# Altium schematic sheet MCU_CU Schematic.SchDoc: Title
size A3; SheetTitle: MCU_CU Schematic; ApprovalDate: dd/mm/yyyy; DesignedBy: Boris Sharff; PageSetup: Record=PageOptions|CenterHorizontal=True|CenterVertical=True|PrintScale=1.01|XCorrection=1.00|YCorrection=1.00|PrintKind=1|BorderSize=5000000|LeftOffset=0|BottomOffset=0|Orientation=2|PaperLength=1000|PaperWidth=1000|Scale=100|PaperSource=7|PrintQuality=600|MediaType=1|DitherType=10|PaperKind=A3 (297 x 420mm)|PrintScaleMode=1; Title2: MCU_CU Schematic; Date: *******; ApprovedBy: *******; CheckedBy: None; Author: *******; CompanyName: *******; DrawnBy: Name; Engineer: *******; Organization: *******; Address1: *******; Address2: *******; Address3: *******; Address4: *******; DocumentNumber: Doc Num; Revision: *******; SheetNumber: 1; SheetTotal: *******; CurrentTime: *******; CurrentDate: *******; Time: *******; DocumentFullPathAndName: *******; DocumentName: *******; ModifiedDate: *******; ImagePath: *******; ProjectName: *******; Application_BuildNumber: *******
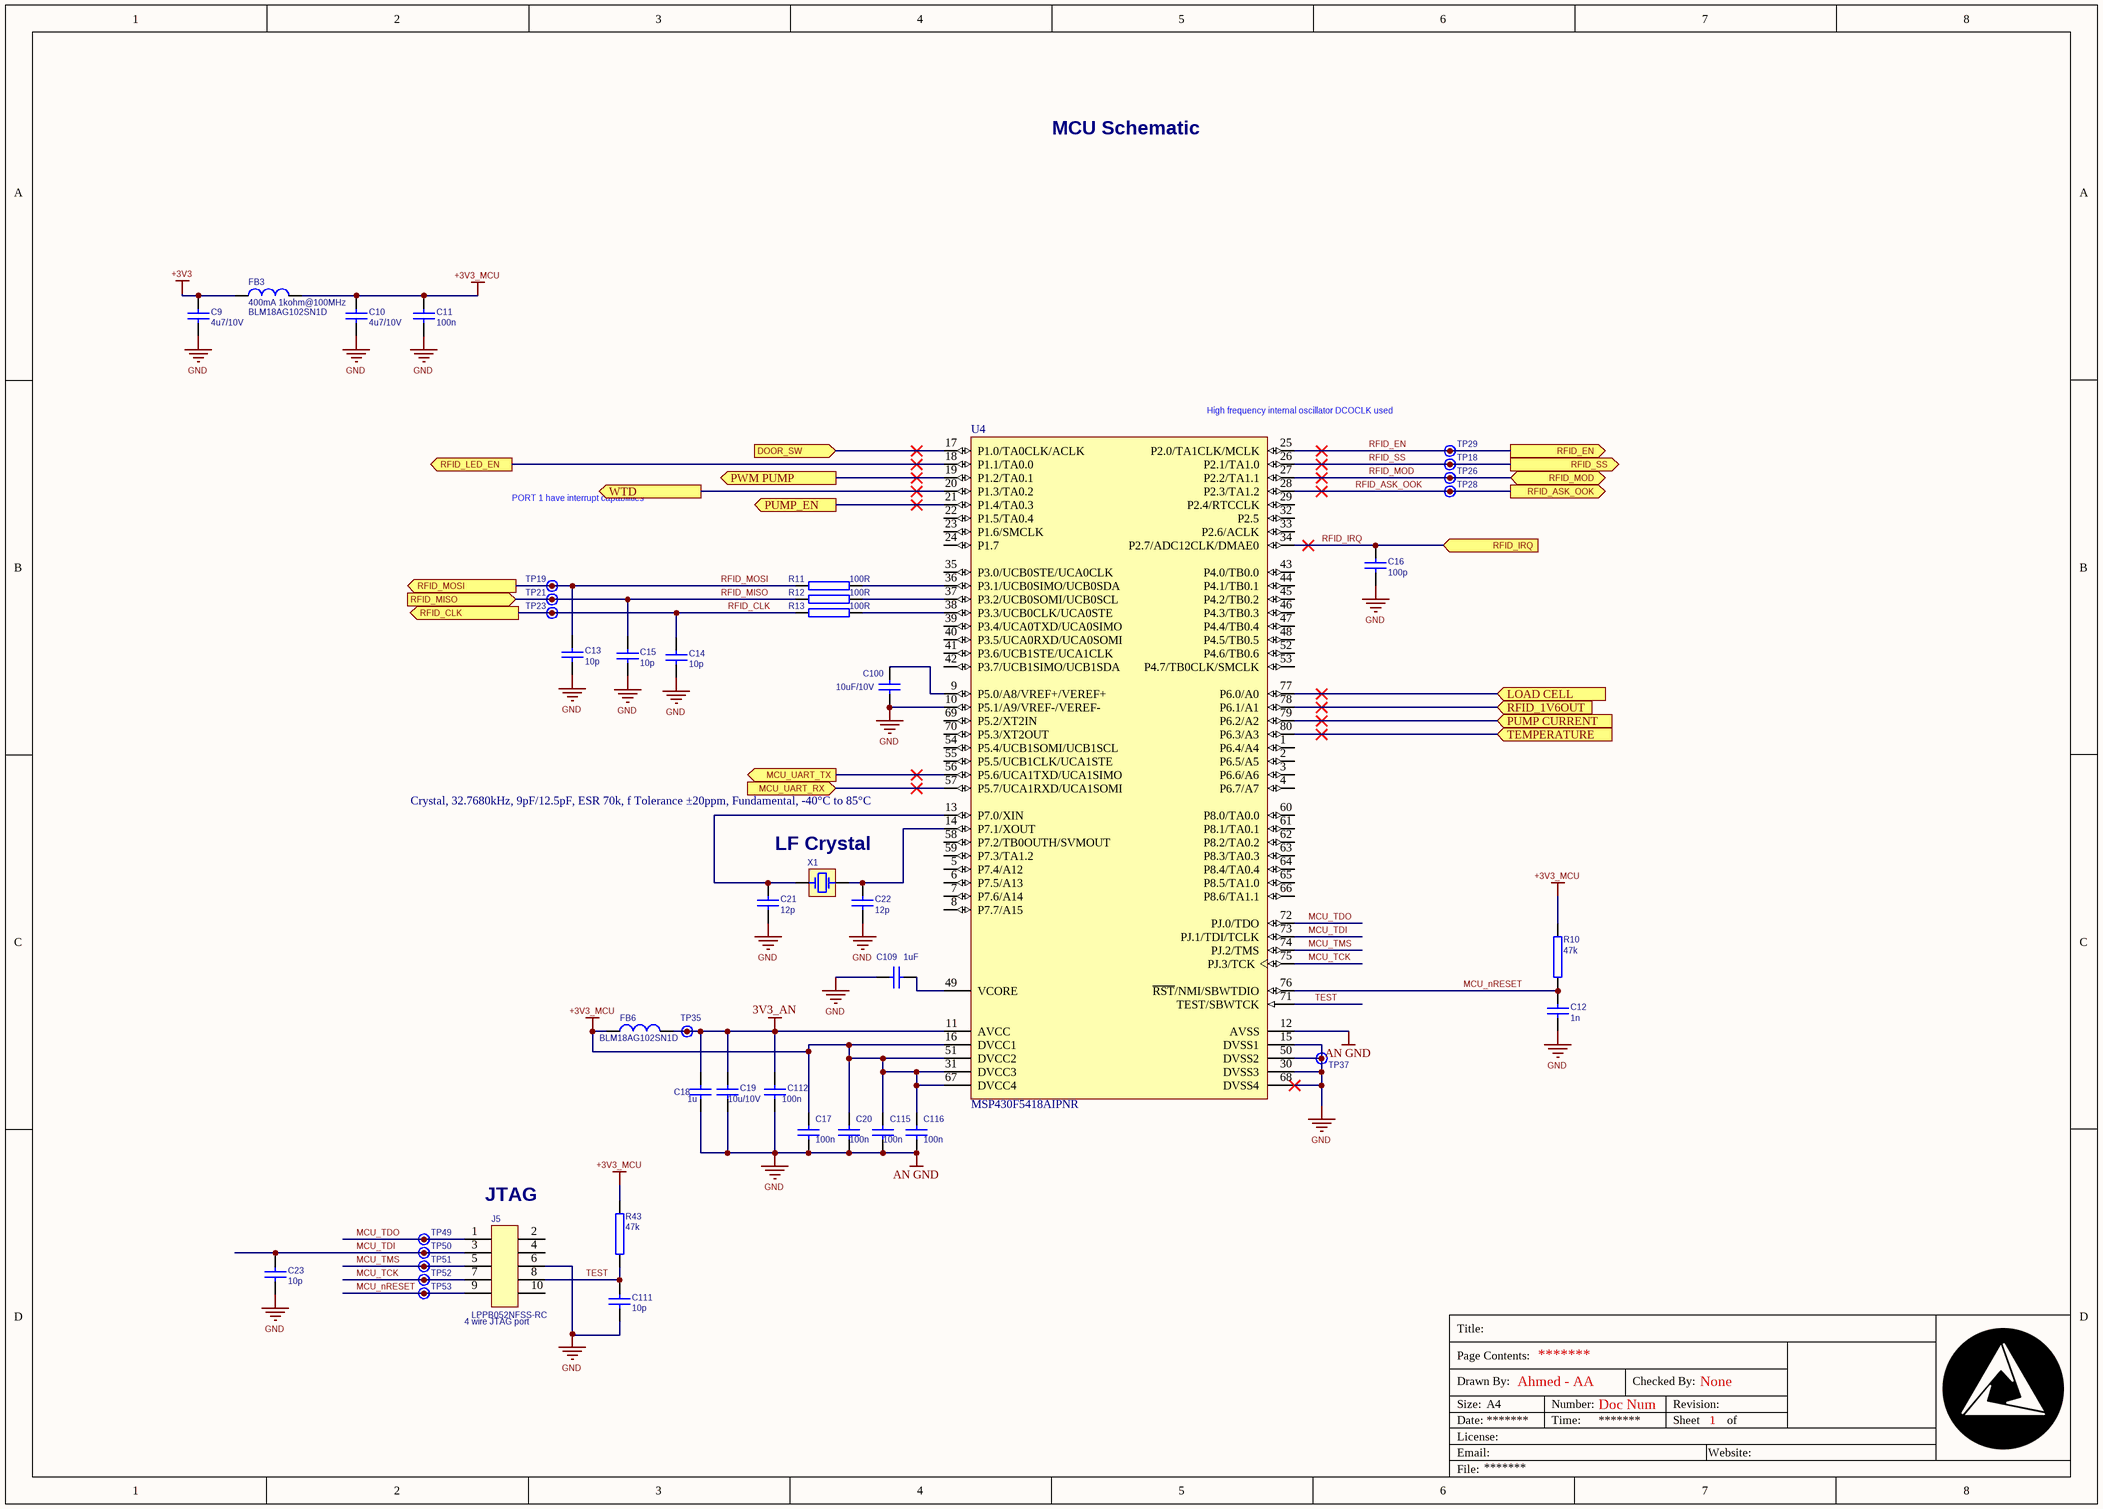
[diagram p0: MCU_CU Schematic.SchDoc]

## Parts
C9  4u7/10V  [CAPC1608X09N(0603)]
C10  4u7/10V  [CAPC1608X09N(0603)]
C11  100n  [CAPC1608X09N(0603)]
C12  1n  [CAPC1608X09N(0603)]
C13  10p  [CAPC1608X09N(0603)]
C14  10p  [CAPC1608X09N(0603)]
C15  10p  [CAPC1608X09N(0603)]
C16  100p  [CAPC1608X09N(0603)]
C17  100n  [CAPC1608X09N(0603)]
C18  1u  [CAPC1608X09N(0603)]
C19  10u/10V  [CAPC1608X09N(0603)]
C20  100n  [CAPC1608X09N(0603)]
C21  12p  [CAPC1608X09N(0603)]
C22  12p  [CAPC1608X09N(0603)]
C23  10p  [CAPC1608X09N(0603)]
C100  10uF/10V  [CAPC1608X09N(0603)]
C109  1uF  [CAPC1608X09N(0603)]
C111  10p  [CAPC1608X09N(0603)]
C112  100n  [CAPC1608X09N(0603)]
C115  100n  [CAPC1608X09N(0603)]
C116  100n  [CAPC1608X09N(0603)]
FB3  400mA 1kohm@100MHz  [RESC1608X06N]
FB6  400mA 1kohm@100MHz  [RESC1608X06N]  (value not drawn)
J5  LPPB052NFSS-RC  [2x 5, 1.27mm Pitch]
R10  47k  [RESC1608X06N(0603)]
R11  100R  [RESC1608X06N(0603)]
R12  100R  [RESC1608X06N(0603)]
R13  100R  [RESC1608X06N(0603)]
R43  47k  [RESC1608X06N(0603)]
TP18  LFX_P  [Test Point 1mm]  (value not drawn)  (no BOM)
TP19  LFX_P  [Test Point 1mm]  (value not drawn)  (no BOM)
TP21  LFX_P  [Test Point 1mm]  (value not drawn)  (no BOM)
TP23  LFX_P  [Test Point 1mm]  (value not drawn)  (no BOM)
TP26  LFX_P  [Test Point 1mm]  (value not drawn)  (no BOM)
TP28  LFX_P  [Test Point 1mm]  (value not drawn)  (no BOM)
TP29  LFX_P  [Test Point 1mm]  (value not drawn)  (no BOM)
TP35  LFX_P  [Test Point 1mm]  (value not drawn)  (no BOM)
TP37  LFX_P  [Test Point 1mm]  (value not drawn)  (no BOM)
TP49  TDO  [Test Point 1mm]  (value not drawn)  (no BOM)
TP50  TDO  [Test Point 1mm]  (value not drawn)  (no BOM)
TP51  TDO  [Test Point 1mm]  (value not drawn)  (no BOM)
TP52  TDO  [Test Point 1mm]  (value not drawn)  (no BOM)
TP53  TDO  [Test Point 1mm]  (value not drawn)  (no BOM)
U4  MSP430F5418AIPNR  [PN0080A_L]
X1  CM315D32768DZCT  [CM315D32768DZCT]  (value not drawn)

## Ports
DOOR_SW (in), LOAD CELL (in), MCU_UART_RX (in), MCU_UART_TX (out), PUMP CURRENT (in), PUMP_EN (out), PWM PUMP (out), RFID_1V6OUT (in), RFID_ASK_OOK (out), RFID_CLK (out), RFID_EN (out), RFID_IRQ (in), RFID_LED_EN (out), RFID_MISO (in), RFID_MOD (bidir), RFID_MOSI (out), RFID_SS (out), TEMPERATURE (in), WTD (out)

## Nets
3V3_AN: C18.2 C19.2 C112.2 FB6.2 TP35.TP U4.11(AVCC)
+3V3: C9.2 FB3.1
+3V3_MCU: C10.2 C11.2 C17.2 C20.2 C115.2 C116.2 FB3.2 FB6.1 R10.1 R43.1 U4.16(DVCC1) U4.31(DVCC3) U4.51(DVCC2) U4.67(DVCC4)
AN GND: C9.1 C10.1 C11.1 C12.1 C13.2 C14.2 C15.2 C16.1 C17.1 C18.1 C19.1 C20.1 C21.1 C22.1 C23.2 C100.1 C109.2 C111.2 C112.1 C115.1 C116.1 J5.6 TP37.TP U4.10(P5.1/A9/VREF-/VEREF-) U4.12(AVSS) U4.15(DVSS1) U4.30(DVSS3) U4.50(DVSS2) U4.68(DVSS4)  [also labelled GND]
DOOR_SW: U4.17(P1.0/TA0CLK/ACLK) ; port DOOR_SW
LOAD CELL: U4.77(P6.0/A0) ; port LOAD CELL
MCU_nRESET: C12.2 J5.9 R10.2 TP53.TP U4.76(~{RST}/NMI/SBWTDIO)
MCU_TCK: J5.7 TP52.TP U4.75(PJ.3/TCK)
MCU_TDI: C23.1 J5.3 TP50.TP U4.73(PJ.1/TDI/TCLK)
MCU_TDO: J5.1 TP49.TP U4.72(PJ.0/TDO)
MCU_TMS: J5.5 TP51.TP U4.74(PJ.2/TMS)
MCU_UART_RX: U4.57(P5.7/UCA1RXD/UCA1SOMI) ; port MCU_UART_RX
MCU_UART_TX: U4.56(P5.6/UCA1TXD/UCA1SIMO) ; port MCU_UART_TX
PUMP CURRENT: U4.79(P6.2/A2) ; port PUMP CURRENT
PUMP_EN: U4.21(P1.4/TA0.3) ; port PUMP_EN
PWM PUMP: U4.19(P1.2/TA0.1) ; port PWM PUMP
RFID_1V6OUT: U4.78(P6.1/A1) ; port RFID_1V6OUT
RFID_ASK_OOK: TP28.TP U4.28(P2.3/TA1.2) ; port RFID_ASK_OOK
RFID_CLK: C14.1 R13.2 TP23.TP ; port RFID_CLK
RFID_EN: TP29.TP U4.25(P2.0/TA1CLK/MCLK) ; port RFID_EN
RFID_IRQ: C16.2 U4.34(P2.7/ADC12CLK/DMAE0) ; port RFID_IRQ
RFID_LED_EN: U4.18(P1.1/TA0.0) ; port RFID_LED_EN
RFID_MISO: C15.1 R12.2 TP21.TP ; port RFID_MISO
RFID_MOD: TP26.TP U4.27(P2.2/TA1.1) ; port RFID_MOD
RFID_MOSI: C13.1 R11.2 TP19.TP ; port RFID_MOSI
RFID_SS: TP18.TP U4.26(P2.1/TA1.0) ; port RFID_SS
TEMPERATURE: U4.80(P6.3/A3) ; port TEMPERATURE
TEST: C111.1 J5.8 R43.2 U4.71(TEST/SBWTCK)
WTD: U4.20(P1.3/TA0.2) ; port WTD
NetC21_2: C21.2 U4.13(P7.0/XIN) X1.1(HOT)
NetC22_2: C22.2 U4.14(P7.1/XOUT) X1.2(HOT)
NetC100_2: C100.2 U4.9(P5.0/A8/VREF+/VEREF+)
NetC109_1: C109.1 U4.49(VCORE)
NetR11_1: R11.1 U4.36(P3.1/UCB0SIMO/UCB0SDA)
NetR12_1: R12.1 U4.37(P3.2/UCB0SOMI/UCB0SCL)
NetR13_1: R13.1 U4.38(P3.3/UCB0CLK/UCA0STE)

Not connected (* = marked no-connect by the designer): J5 2 4 10; U4 1(P6.4/A4) 2(P6.5/A5) 3(P6.6/A6) 4(P6.7/A7) 5(P7.4/A12) 6(P7.5/A13) 7(P7.6/A14) 8(P7.7/A15) 22(P1.5/TA0.4) 23(P1.6/SMCLK) 24(P1.7) 29(P2.4/RTCCLK) 32(P2.5) 33(P2.6/ACLK) 35(P3.0/UCB0STE/UCA0CLK) 39(P3.4/UCA0TXD/UCA0SIMO) 40(P3.5/UCA0RXD/UCA0SOMI) 41(P3.6/UCB1STE/UCA1CLK) 42(P3.7/UCB1SIMO/UCB1SDA) 43(P4.0/TB0.0) 44(P4.1/TB0.1) 45(P4.2/TB0.2) 46(P4.3/TB0.3) 47(P4.4/TB0.4) 48(P4.5/TB0.5) 52(P4.6/TB0.6) 53(P4.7/TB0CLK/SMCLK) 54(P5.4/UCB1SOMI/UCB1SCL) 55(P5.5/UCB1CLK/UCA1STE) 58(P7.2/TB0OUTH/SVMOUT) 59(P7.3/TA1.2) 60(P8.0/TA0.0) 61(P8.1/TA0.1) 62(P8.2/TA0.2) 63(P8.3/TA0.3) 64(P8.4/TA0.4) 65(P8.5/TA1.0) 66(P8.6/TA1.1) 69(P5.2/XT2IN) 70(P5.3/XT2OUT)

## Notes on the sheet
- MCU Schematic
- (near U4) High frequency internal oscillator DCOCLK used
- PORT 1 have interrupt capabilities
- LF Crystal
- (near J5) JTAG
- (near J5) 4 wire JTAG port
- Title:
- Drawn By:
- Page Contents:
- Ahmed - AA
- Checked By:
- Size:
- Date:
- File:
- License:
- Email:
- A4
- Number:
- Time:
- Revision:
- Sheet
- Website:
- of

## Library data of the parts
C9 C10 C100 = CC0603KRX5R6BB475: Capacitor, Ceramic, 10V, ±10%, X5R, -55°C to 125°C; 08 Manufacturer: Yageo; 04 Value: 4u7; 06 Package: 0603; 12 Author: K.Sukumar; 05 Footprint Type: SMD; 02 Part Number: CC0603KRX5R6BB475; 03 Description: Capacitor, Ceramic, 10V, ±10%, X5R, -55°C to 125°C; 01 Part Category: Capacitor; 09 Digikey PN: 311-1455-2-ND; ComponentLink1Description: Datasheet; ComponentLink1URL: L:\Datasheet\Capacitor\mlcc01_e.pdf
C11 C17 C20 C112 C115 C116 = GRM188R71H104KA93D: Capacitor, Ceramic, 50V, ±10%, X7R, -55°C to 125°C; 08 Manufacturer: Murata Electronics North America; 06 Package: 0603; 12 Author: D.Grace; 05 Footprint Type: SMD; 02 Part Number: GRM188R71H104KA93D; 03 Description: Capacitor, Ceramic, 50V, ±10%, X7R, -55°C to 125°C; 04 Value: 100n; 01 Part Category: Capacitor; 09 Digikey PN: 490-1519-2-ND; ComponentLink1Description: Datasheet; ComponentLink1URL: L:\Datasheet\Capacitor\c02e.pdf
C12 = GRM1885C1H102JA01D: Capacitor, Ceramic, 50V, ±5%, C0G NP0, -55°C to 125°C; 08 Manufacturer: Murata Electronics North America; 06 Package: 0603; 12 Author: D.Grace; 05 Footprint Type: SMD; 02 Part Number: GRM1885C1H102JA01D; 03 Description: Capacitor, Ceramic, 50V, ±5%, C0G NP0, -55°C to 125°C; 04 Value: 1n; 01 Part Category: Capacitor; 09 Digikey PN: 490-1451-2-ND; ComponentLink1Description: Datasheet; ComponentLink1URL: L:\Datasheet\Capacitor\c02e.pdf
C13-C15 C23 C111 = GQM1885C1H100JB01D: Capacitor, Ceramic, 50V, ±5%, NP0, -55°C to 125°C; 08 Manufacturer: Murata Electronics North America; 06 Package: 0603; 12 Author: M.Fineschi; 05 Footprint Type: SMD; 02 Part Number: GQM1885C1H100JB01D; 03 Description: Capacitor, Ceramic, 50V, ±5%, NP0, -55°C to 125°C; 04 Value: 10p; 01 Part Category: Capacitor; 09 Digikey PN: 490-3570-1-ND; ComponentLink1Description: Datasheet; ComponentLink1URL: L:\Datasheet\Capacitor\c02e.pdf
C16 = GRM1885C1H101JA01D: Capacitor, Ceramic, 50V, ±5%, C0G NP0, -55°C to 125°C; 08 Manufacturer: Murata Electronics North America; 06 Package: 0603; 12 Author: D.Grace; 05 Footprint Type: SMD; 02 Part Number: GRM1885C1H101JA01D; 03 Description: Capacitor, Ceramic, 50V, ±5%, C0G NP0, -55°C to 125°C; 04 Value: 100p; 01 Part Category: Capacitor; 09 Digikey PN: 490-1427-2-ND; 10 Alternate Supplier: Mouser; 11 Alternate Supplier PN: 81-GRM39C101J50; ComponentLink1Description: Datasheet; ComponentLink1URL: L:\Datasheet\Capacitor\c02e.pdf
C18 = GRM188R71E105KA12D: Capacitor, Ceramic, 25V, ±10%, X7R, -55°C to 125°C; 08 Manufacturer: Murata Electronics North America; 06 Package: 0603; 12 Author: D.Grace; 05 Footprint Type: SMD; 02 Part Number: GRM188R71E105KA12D; 03 Description: Capacitor, Ceramic, 25V, ±10%, X7R, -55°C to 125°C; 04 Value: 1u; 01 Part Category: Capacitor; 09 Digikey PN: 490-5307-2-ND; ComponentLink1Description: Datasheet; ComponentLink1URL: L:\Datasheet\Capacitor\c02e.pdf
C19 = C1608X5R1A106M080AC: Capacitor, Ceramic, 10V, ±20%, X5R, -55°C to 85°C; 08 Manufacturer: TDK Corporation; 04 Value: 10u; 06 Package: 0603; 12 Author: K.Sukumar; 05 Footprint Type: SMD; 02 Part Number: C1608X5R1A106M080AC; 03 Description: Capacitor, Ceramic, 10V, ±20%, X5R, -55°C to 85°C; 01 Part Category: Capacitor; 09 Digikey PN: 445-6853-2-ND; ComponentLink1Description: Datasheet; ComponentLink1URL: L:\Datasheet\Capacitor\mlcc_commercial_general_en.pdf
C21 C22 = CMP-007-0078-1: Capacitor, Ceramic, 50V, ±5%, C0G NP0, -55°C to 125°C; 02 Part Number: GRM1885C1H120JA01D; 08 Manufacturer: Murata Electronics North America; 06 Package: 0603; 12 Author: D.Grace; 05 Footprint Type: SMD; 03 Description: Capacitor, Ceramic, 50V, ±5%, C0G NP0, -55°C to 125°C; 04 Value: 12p; 01 Part Category: Capacitor; 09 Digikey PN: 490-1405-2-ND; 10 Alternate Supplier: Mouser; 11 Alternate Supplier PN: 81-GRM39C120J50; ComponentLink1Description: Datasheet; ComponentLink1URL: L:\Datasheet\Capacitor\c02e.pdf; Component Name: GRM1885C1H120JA01D
C109 = CC0603KRX5R6BB475: Capacitor, Ceramic, 10V, ±10%, X5R, -55°C to 125°C; 08 Manufacturer: Yageo; 04 Value: 470nF; 06 Package: 0603; 12 Author: K.Sukumar; 05 Footprint Type: SMD; 02 Part Number: CC0603KRX5R6BB475; 03 Description: Capacitor, Ceramic, 10V, ±10%, X5R, -55°C to 125°C; 01 Part Category: Capacitor; 09 Digikey PN: 311-1455-2-ND; ComponentLink1Description: Datasheet; ComponentLink1URL: L:\Datasheet\Capacitor\mlcc01_e.pdf
FB3 FB6 = BLM18AG102SN1D: Ferrite Bead, 1kohm@100MHz, 400mA, 500mohm, -55 to 125C; 01 Part Category: Filter; 08 Manufacturer: Murata; 06 Package: 0603; 05 Footprint Type: SMD; 12 Author: M.Fineschi; 02 Part Number: BLM18AG102SN1D; 03 Description: Ferrite Bead, 1kohm@100MHz, 400mA, 500mohm, -55 to 125C; 04 Value: 1kohm@100MHz; ComponentLink1Description: Datasheet; ComponentLink1URL: L:\Datasheet\Filter\L0110S0100BLM18A.pdf; 09 Digikey PN: 490-1015-2-ND; 10 Alternate Supplier: BLM18AG102SN1D
J5 = LPPB052NFSS-RC: Socket,  Female, 2x5, 10 POS, Pitch 1.27mm; 01 Part Category: Connector; 08 Manufacturer: Sullins; 06 Package: SMD; 12 Author: K.Sukumar; 03 Description: Socket,  Female, 2x5, 10 POS, Pitch 1.27mm; 04 Value: LPPB052NFSS-RC; 09 Digikey PN: S9006E-05-ND; 05 Footprint Type: SMD; ComponentLink1Description: Datasheet; ComponentLink1URL: L:\Datasheet\Connector\Sullins_HEADER_.050_1.27mm_FEMALE.pdf; 02 Part Number: LPPB052NFSS-RC
R10 R43 = RC0603FR-0747KL: Resistor, Thick Film, 0.1W, ±1%, ±100ppm/°C; 08 Manufacturer: Yageo; 13 Reviewed By: P.Moutzouris; 06 Package: 0603; 12 Author: D.Grace; 05 Footprint Type: SMD; 02 Part Number: RC0603FR-0747KL; 03 Description: Resistor, Thick Film, 0.1W, ±1%, ±100ppm/°C; 04 Value: 47k; 09 Digikey PN: 311-47.0KHRTR-ND; 01 Part Category: Resistor; ComponentLink1Description: Datasheet; ComponentLink1URL: L:\Datasheet\Resistor\PYu-RC0603_51_RoHS_L_4.pdf
R11-R13 = RC0603FR-07100RL: Resistor, Thick Film, 0.1W, ±1%, ±100ppm/°C; 08 Manufacturer: Yageo; 13 Reviewed By: P.Moutzouris; 06 Package: 0603; 12 Author: D.Grace; 05 Footprint Type: SMD; 02 Part Number: RC0603FR-07100RL; 03 Description: Resistor, Thick Film, 0.1W, ±1%, ±100ppm/°C; 04 Value: 100R; 09 Digikey PN: 311-100HRTR-ND; 01 Part Category: Resistor; ComponentLink1Description: Datasheet; ComponentLink1URL: L:\Datasheet\Resistor\PYu-RC0603_51_RoHS_L_4.pdf
TP18 TP19 TP21 TP23 TP26 TP28 TP29 TP35 TP37 TP49-TP53 = Test Point: 01 Part Category: PCB; 12 Author: D.Grace
U4 = CMP-0365-00449-2: 25 MHz Mixed Signal Microcontroller with 128 KB Flash, 16384 B SRAM and 67 GPIOs, -40 to 85 degC, 80-pin QFP (PN), Green (RoHS & no Sb/Br); Manufacturer: Texas Instruments; ADC: 12-bit SAR; Multiplier: 32x32; SRAM(B): 16384; Watchdog: Yes; Timers - 16-bit: 3; SubFamily: 5 Series; Frequency(MHz): 25; GPIO: 67; Flash(KB): 128; USCI_B (I2C & SPI): 2; ADC Channels: 16; DatasheetVersion: SLAS655B; ComponentLink3Description: Package Specification; ComponentLink1URL: http://www.ti.com/; Temp Sensor: Yes; PartNumber: MSP430F5418AIPNR; ComponentLink2Description: Datasheet; DMA: 3; ComponentLink3URL: http://www.ti.com/lit/ml/mtqf010a/mtqf010a.pdf; Brown Out Reset: Yes; Mounting Technology: Surface Mount; PackageReference: PN0080A; Eco-Plan: Green (RoHS & no Sb/Br); ComponentLink1Description: Manufacturer URL; USCI_A (UART/LIN/IrDA/SPI): 2; Code_JEDEC: MS-018; SVS: Yes; Real-Time Clock: Yes; PackageDescription: 80-Pin Plastic Quad Flat Pack, Body 12 x 12 mm, Pitch 0.5 mm; ComponentLink2URL: http://www.ti.com/general/docs/lit/getliterature.tsp?genericPartNumber=MSP430F5418A&fileType=pdf
X1 = CMP-007-0044-1: Crystal, 32.7680kHz, 9pF/12.5pF, ESR 70k, f Tolerance ±20ppm, Fundamental, -40°C to 85°C; 08 Manufacturer: Citizen Finedevice Co Ltd; 05 Footprint Type: SMD; 06 Package: 1206; 12 Author: D.Grace; 04 Value: CM315D32768DZCT; Component Name: CM315D32768DZCT; 01 Part Category: Crystal; 02 Part Number: CM315D32768DZCT; 03 Description: Crystal, 32.7680kHz, 9pF/12.5pF, ESR 70k, f Tolerance ±20ppm, Fundamental, -40°C to 85°C; 09 Digikey PN: 300-8813-2-ND; ComponentLink1Description: Datasheet; ComponentLink1URL: L:\Datasheet\Crystal\CM315D.pdf